# EAGLE design montaj_board_v2.0 (EAGLE 9.6.2)
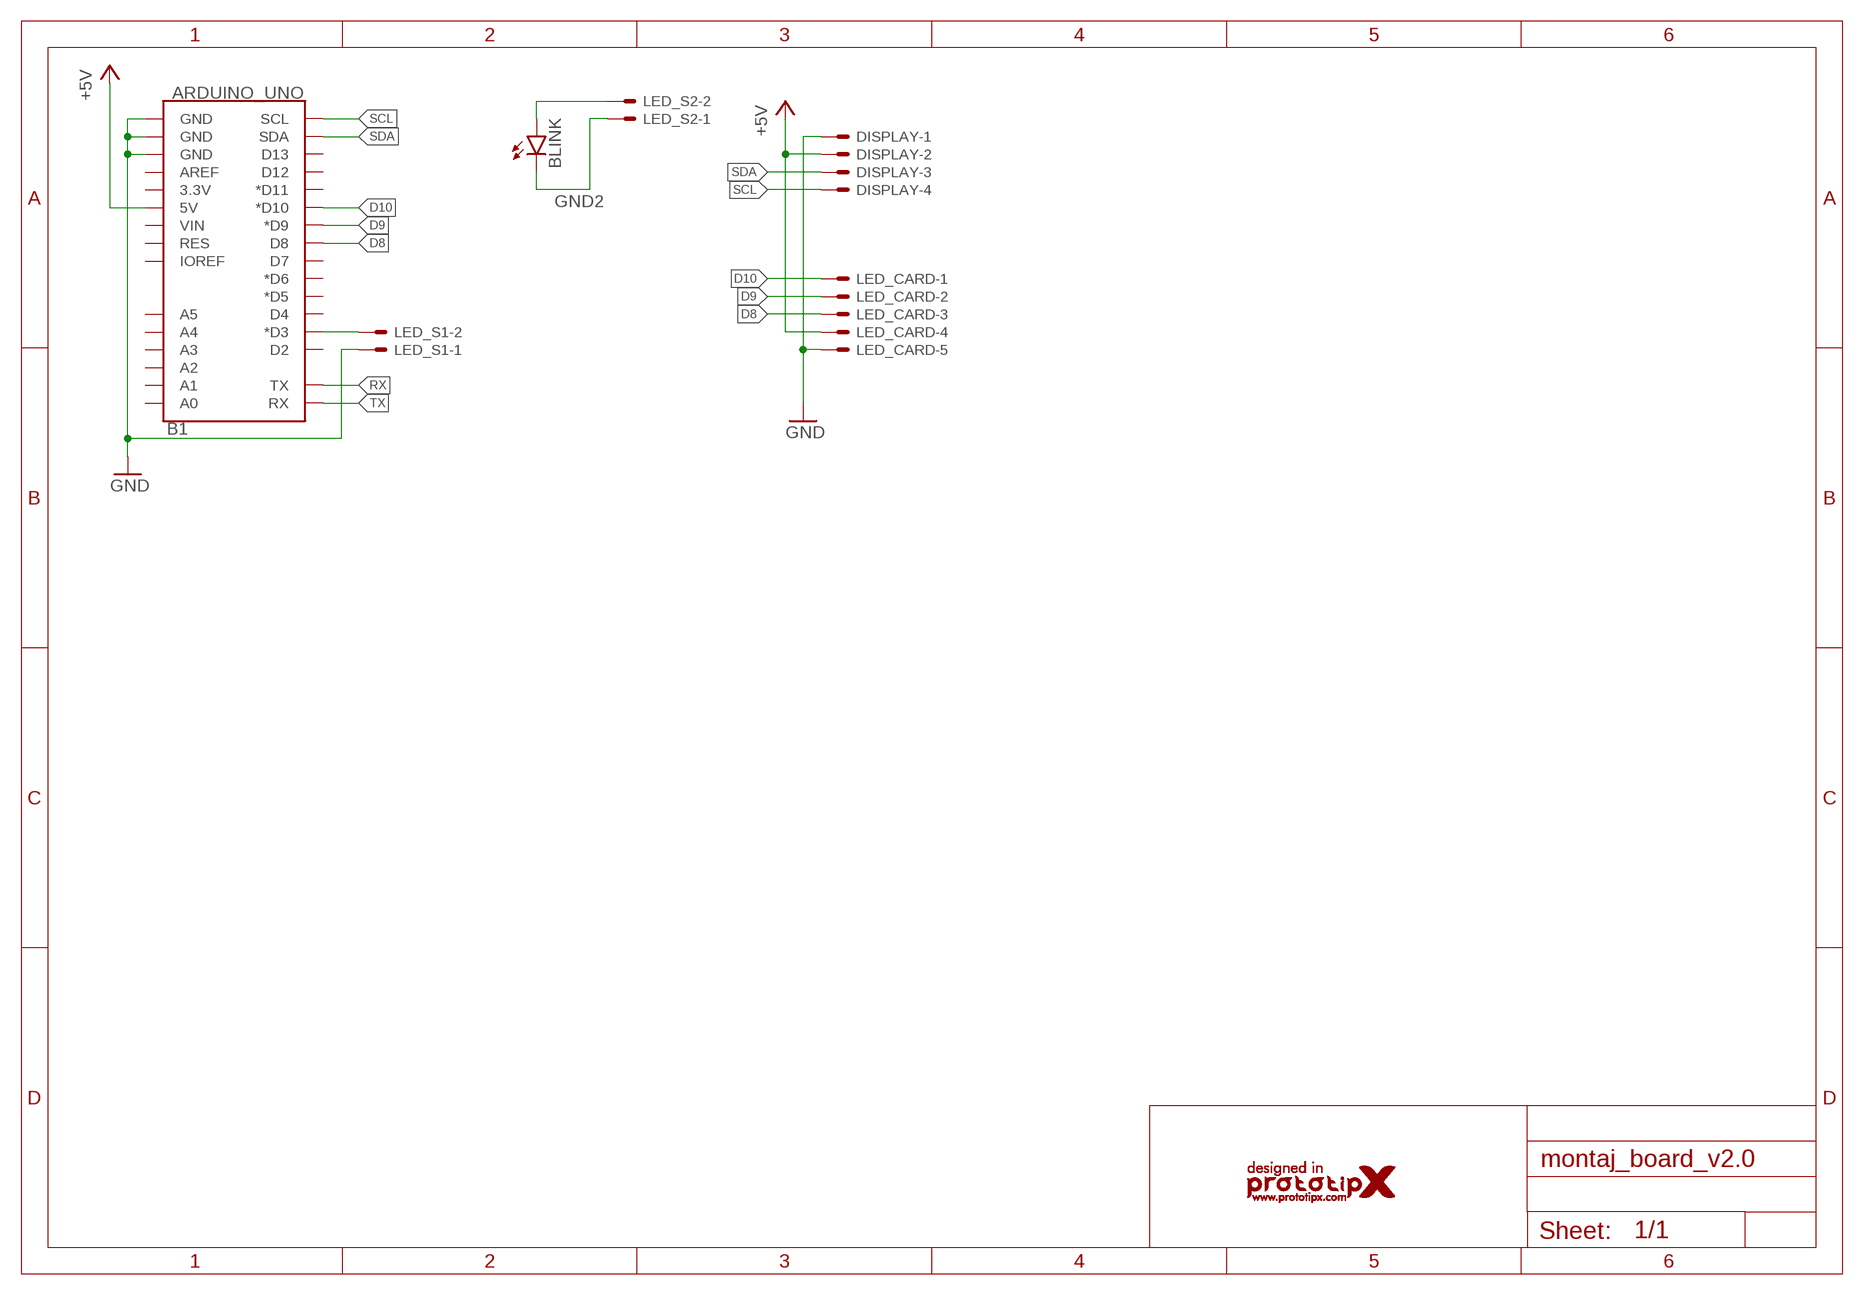
[diagram p0: schematic, sheet 1]

## Parts
B1  ARDUINO_UNO  ARDUINO_UNO_R3_SHIELDBASIC  [UNO_R3_SHIELD]
BLINK  LED3MM  [LED3MM]
DISPLAY  C-GRID-04-70543  [70543-04]
LED_CARD  C-GRID-05-70543  [70543-05]
LED_S1  C-GRID-02-70543  [70543-02]
LED_S2  C-GRID-02-70543  [70543-02]
LOGO1  PROTOTIPXDESIGN  [PROTOTIPX_DESING_20MM]

## Nets
+5V: B1.5V DISPLAY.2 LED_CARD.4
D8: B1.D8 LED_CARD.3
D9: B1.D9(*D9) LED_CARD.2
D10: B1.D10(*D10) LED_CARD.1
GND: B1.GND@0(GND) B1.GND@1(GND) B1.GND@2(GND) DISPLAY.1 LED_CARD.5 LED_S1.1
GND2: BLINK.K(C) LED_S2.1
N$1: B1.D3(*D3) LED_S1.2
N$3: BLINK.A LED_S2.2
RX: B1.TX
SCL: B1.SCL DISPLAY.4
SDA: B1.SDA DISPLAY.3
TX: B1.RX
Unconnected: B1.3.3V B1.A0 B1.A1 B1.A2 B1.A3 B1.A4 B1.A5 B1.AREF B1.D2 B1.D4 B1.D5(*D5) B1.D6(*D6) B1.D7 B1.D11(*D11) B1.D12 B1.D13 B1.IOREF B1.RES B1.VIN

## Library data of the parts
B1 = SparkFun-Boards:ARDUINO_UNO_R3_SHIELD: Arduino R3 Shield Footprint Shield form compatible with the Arduino Uno R3. SparkFun Products: MG2639 Cellular Shield <https://www.sparkfun.com/products/13120> MIDI Shield <https://www.sparkfun.com/products/12898> R3 Stackable Headers Kit <https://www.sparkfun.com/products/11417>
BLINK = led:LED: LED OSRAM: - CHIPLED LG R971, LG N971, LY N971, LG Q971, LY Q971, LO R971, LY R971 LH N974, LH R974 LS Q976, LO Q976, LY Q976 LO Q996 - Hyper CHIPLED LW Q18S LB Q993, LB Q99A, LB R99A - SideLED LS A670, LO A670, LY A670, LG A670, LP A670 LB A673, LV A673, LT A673, LW A673 LH A674 LY A675 LS A676, LA A676, LO A676, LY A676, LW A676 LS A679, LY A679, LG A679 - Hyper Micro SIDELED® LS Y876, LA Y876, LO Y876, LY Y876 LT Y87S - SmartLED LW L88C, LW L88S LB L89C, LB L89S, LG L890 LS L89K, LO L89K, LY L89K LS L896, LA L896, LO L896, LY L896 - TOPLED LS T670, LO T670, LY T670, LG T670, LP T670 LSG T670, LSP T670, LSY T670, LOP T670, LYG T670 LG T671, LOG T671, LSG T671 LB T673, LV T673, LT T673, LW T673 LH T674 LS T676, LA T676, LO T676, LY T676, LB T676, LH T676, LSB T676, LW T676 LB T67C, LV T67C, LT T67C, LS T67K, LO T67K, LY T67K, LW E67C LS E67B, LA E67B, LO E67B, LY E67B, LB E67C, LV E67C, LT E67C LW T67C LS T679, LY T679, LG T679 LS T770, LO T770, LY T770, LG T770, LP T770 LB T773, LV T773, LT T773, LW T773 LH T774 LS E675, LA E675, LY E675, LS T675 LS T776, LA T776, LO T776, LY T776, LB T776 LHGB T686 LT T68C, LB T68C - Hyper Mini TOPLED® LB M676 - Mini TOPLED Santana® LG M470 LS M47K, LO M47K, LY M47K Source: http://www.osram.convergy.de LUXEON: - LUMILED® LXK2-PW12-R00, LXK2-PW12-S00, LXK2-PW14-U00, LXK2-PW14-V00 LXK2-PM12-R00, LXK2-PM12-S00, LXK2-PM14-U00 LXK2-PE12-Q00, LXK2-PE12-R00, LXK2-PE12-S00, LXK2-PE14-T00, LXK2-PE14-U00 LXK2-PB12-K00, LXK2-PB12-L00, LXK2-PB12-M00, LXK2-PB14-N00, LXK2-PB14-P00, LXK2-PB14-Q00 LXK2-PR12-L00, LXK2-PR12-M00, LXK2-PR14-Q00, LXK2-PR14-R00 LXK2-PD12-Q00, LXK2-PD12-R00, LXK2-PD12-S00 LXK2-PH12-R00, LXK2-PH12-S00 LXK2-PL12-P00, LXK2-PL12-Q00, LXK2-PL12-R00 Source: www.luxeon.com KINGBRIGHT: KA-3528ASYC Source: www.kingbright.com
DISPLAY = con-molex:C-GRID-04: CONNECTOR wire to board 2.54 mm (0.100") pitch header; MF: MOLEX; OC_FARNELL: unknown; OC_NEWARK: unknown
LED_CARD = con-molex:C-GRID-05: CONNECTOR wire to board 2.54 mm (0.100") pitch header; MF: MOLEX; OC_FARNELL: unknown; OC_NEWARK: unknown
LED_S1 LED_S2 = con-molex:C-GRID-02: CONNECTOR wire to board 2.54 mm (0.100") pitch header; MF: MOLEX; OC_FARNELL: unknown; OC_NEWARK: unknown
LOGO1 = 1-my-library:PROTOTIPX

## Board
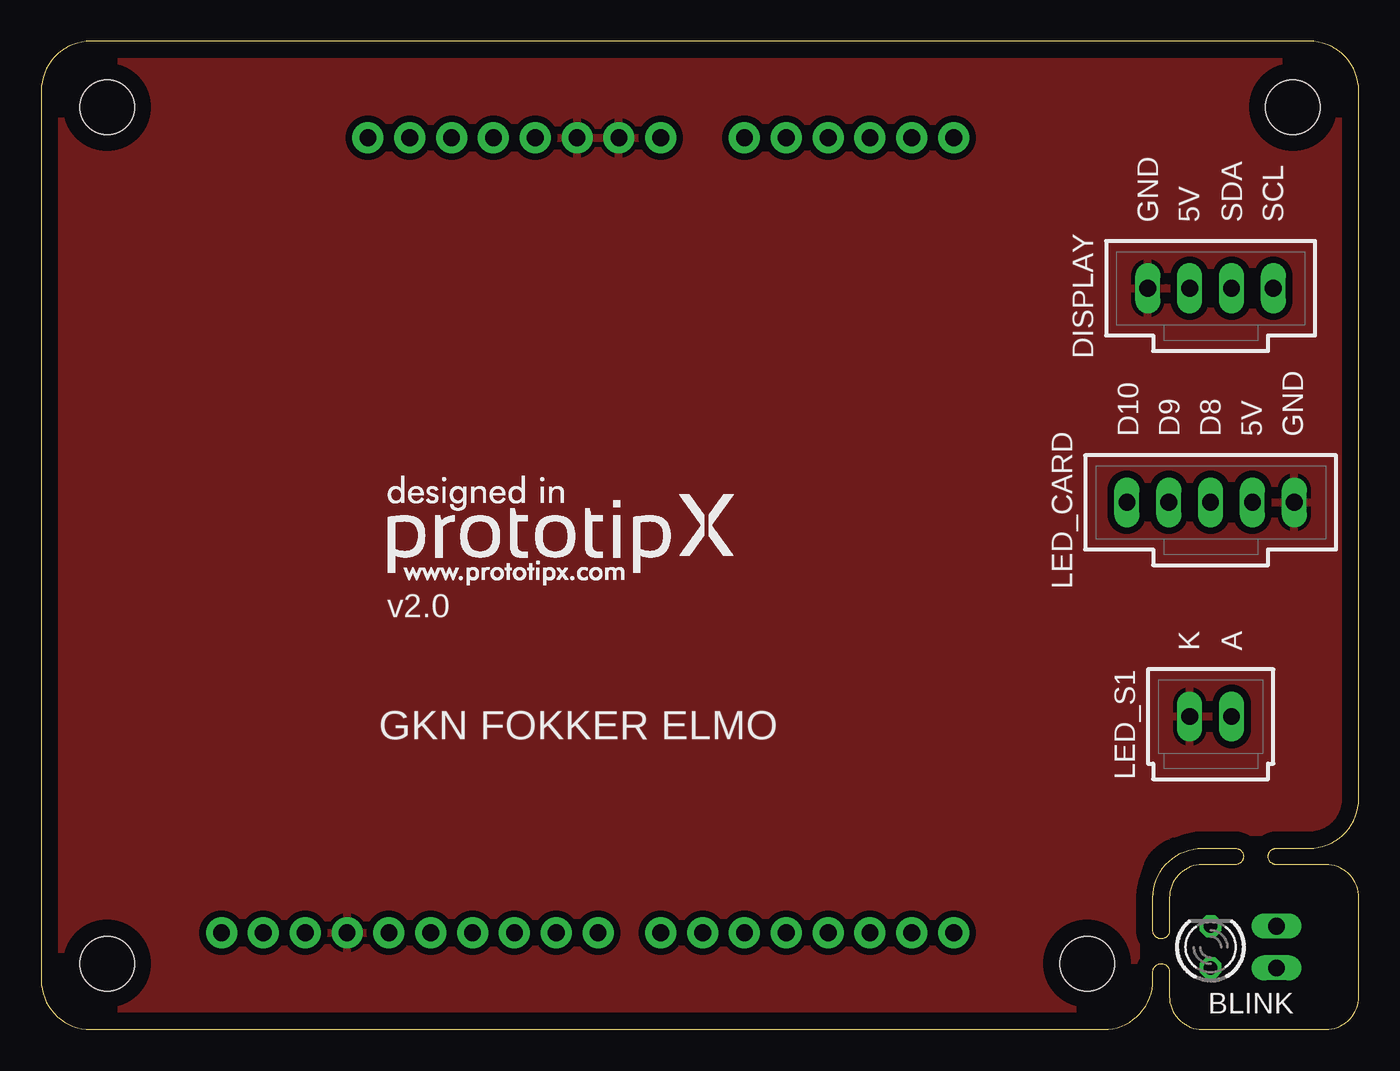
[diagram p1: board, top side]
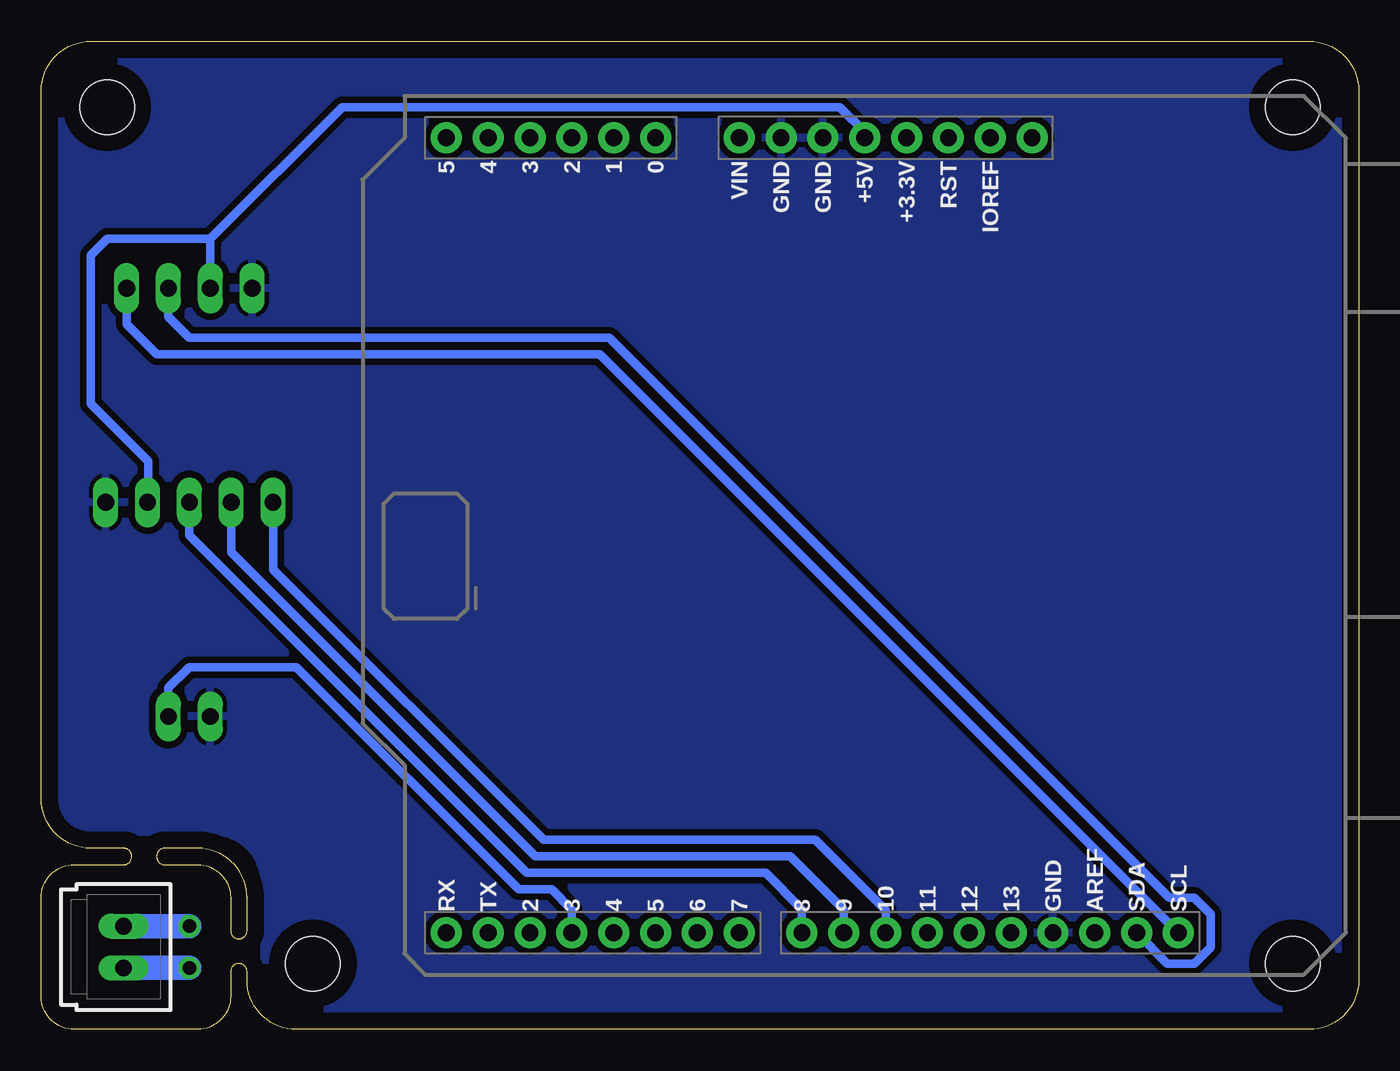
[diagram p2: board, bottom side, seen from below]

Size 80 x 60 mm. Coordinates in mm from the lower left corner, seen from the top.
Outline: 0,57 0,3 arc90 3,0 64.5,0 arc90 67.5,3 67.5,3.5 arc-90 68,4 arc-90 68.5,3.5 68.5,2 arc90 70.5,0 78,0 arc90 80,2 80,8 arc90 78,10 75,10 arc-90 74.5,10.5 arc-90 75,11 77,11 arc90 80,14 80,57 arc90 77,60 3,60 arc90 0,57
Outline: 72.5,10 70.5,10 arc90 68.5,8 68.5,6 arc-90 68,5.5 arc-90 67.5,6 67.5,8 arc-90 70.5,11 72.5,11 arc-90 73,10.5 arc-90 72.5,10
Copper layers (1*16): Top 0.035mm / dielectric 1.5mm / Bottom 0.035mm
Design rules "default *": minimum track width 0.3mm, minimum drill 0.5mm, track to track 0.4mm, track to pad 0.4mm, pad to pad 0.4mm, via to via 0.4mm, smd to smd 6mil, copper to edge 40mil, drill to drill 6mil, minimum pad ring 10mil, minimum via ring 8mil, stop-mask expansion 4mil, vias tented up to drill 0mil, thermal gap 10mil
Holes 3.3 mm at 4,56 4,4 63.5,4 76,56

### Footprints (pad centres in the part's own frame; a part is rotated, then mirrored left to right if it is on the bottom)
UNO_R3_SHIELD = drill 1.016 pad 1.88: 3.3V 24.13,-2.54; 5V 24.13,0; A0 24.13,12.7; A1 24.13,15.24; A2 24.13,17.78; A3 24.13,20.32; A4 24.13,22.86; A5 24.13,25.4; AREF -24.13,-13.97; D2 -24.13,20.32; D3 -24.13,17.78; D4 -24.13,15.24; D5 -24.13,12.7; D6 -24.13,10.16; D7 -24.13,7.62; D8 -24.13,3.81; D9 -24.13,1.27; D10 -24.13,-1.27; D11 -24.13,-3.81; D12 -24.13,-6.35; D13 -24.13,-8.89; GND@0 24.13,2.54; GND@1 24.13,5.08; GND@2 -24.13,-11.43; IOREF 24.13,-7.62; NC 24.13,-10.16; RES 24.13,-5.08; RX -24.13,25.4; SCL -24.13,-19.05; SDA -24.13,-16.51; TX -24.13,22.86; VIN 24.13,7.62
LED3MM = drill 0.813 octagon: A -1.27,0; K 1.27,0
70543-04 = drill 1.016 long: 1 -3.81,0; 2 -1.27,0; 3 1.27,0; 4 3.81,0
70543-05 = drill 1.016 long: 1 -5.08,0; 2 -2.54,0; 3 0,0; 4 2.54,0; 5 5.08,0
70543-02 = drill 1.016 long: 1 -1.27,0; 2 1.27,0

### Placement (x,y rotation side)
B1  30,30 90 bottom
BLINK  71,5 90 top
DISPLAY  71,45 0 top
LED_CARD  71,32 0 top
LED_S1  71,19 0 top
LED_S2  75,5 270 bottom
LOGO1  21,27 0 top

### Tracks (layer width: path | path; a pad name or v marks a point on that pad's centre or on a via)
+5V
  Bottom 0.508: DISPLAY.2 69.73,48 | 69.73,48 76,48 77,47 77,38 73.5,34.5 73.5,32.04 LED_CARD.4 | B1.5V 30,54.5 31.5,56 61.73,56 69.73,48
D8
  Bottom 0.508: LED_CARD.3 71,30 50.51,9.51 36.01,9.51 33.81,7.31 B1.D8
D9
  Bottom 0.508: B1.D9 31.27,7.27 34.52,10.52 50.02,10.52 68.46,28.96 LED_CARD.2
D10
  Bottom 0.508: B1.D10 28.73,7.23 33,11.5 49.5,11.5 65.92,27.92 LED_CARD.1
GND
  pour Top (rank 2): 0,60 0,0 66.5,0 66.5,9 arc-90 69.5,12 80,12 80,60
  pour Bottom (rank 2): 0,0 0,60 80,60 80,12 69.5,12 arc90 66.5,9 66.5,0
GND2
  Bottom 1.5: LED_S2.1 BLINK.K
N$1
  Bottom 0.508: B1.D3 47.78,7.28 49,8.5 51,8.5 64.5,22 71,22 72.27,20.73 LED_S1.2
N$3
  Bottom 1.5: LED_S2.2 BLINK.A
SCL
  Bottom 0.508: DISPLAY.4 74.81,42.81 72.99,40.99 46.07,40.99 B1.SCL
SDA
  Bottom 0.508: DISPLAY.3 72.27,43.27 71,42 45.5,42 11.5,8 10,8 9,7 9,5 10,4 11.62,4 B1.SDA

### Text on the board
tPlace: GND | 5V | SDA | SCL | D10 | D9 | D8 | 5V | GND | v2.0 | K | A
tNames: GKN FOKKER ELMO